# EAGLE design Reason (EAGLE 6.5.0)
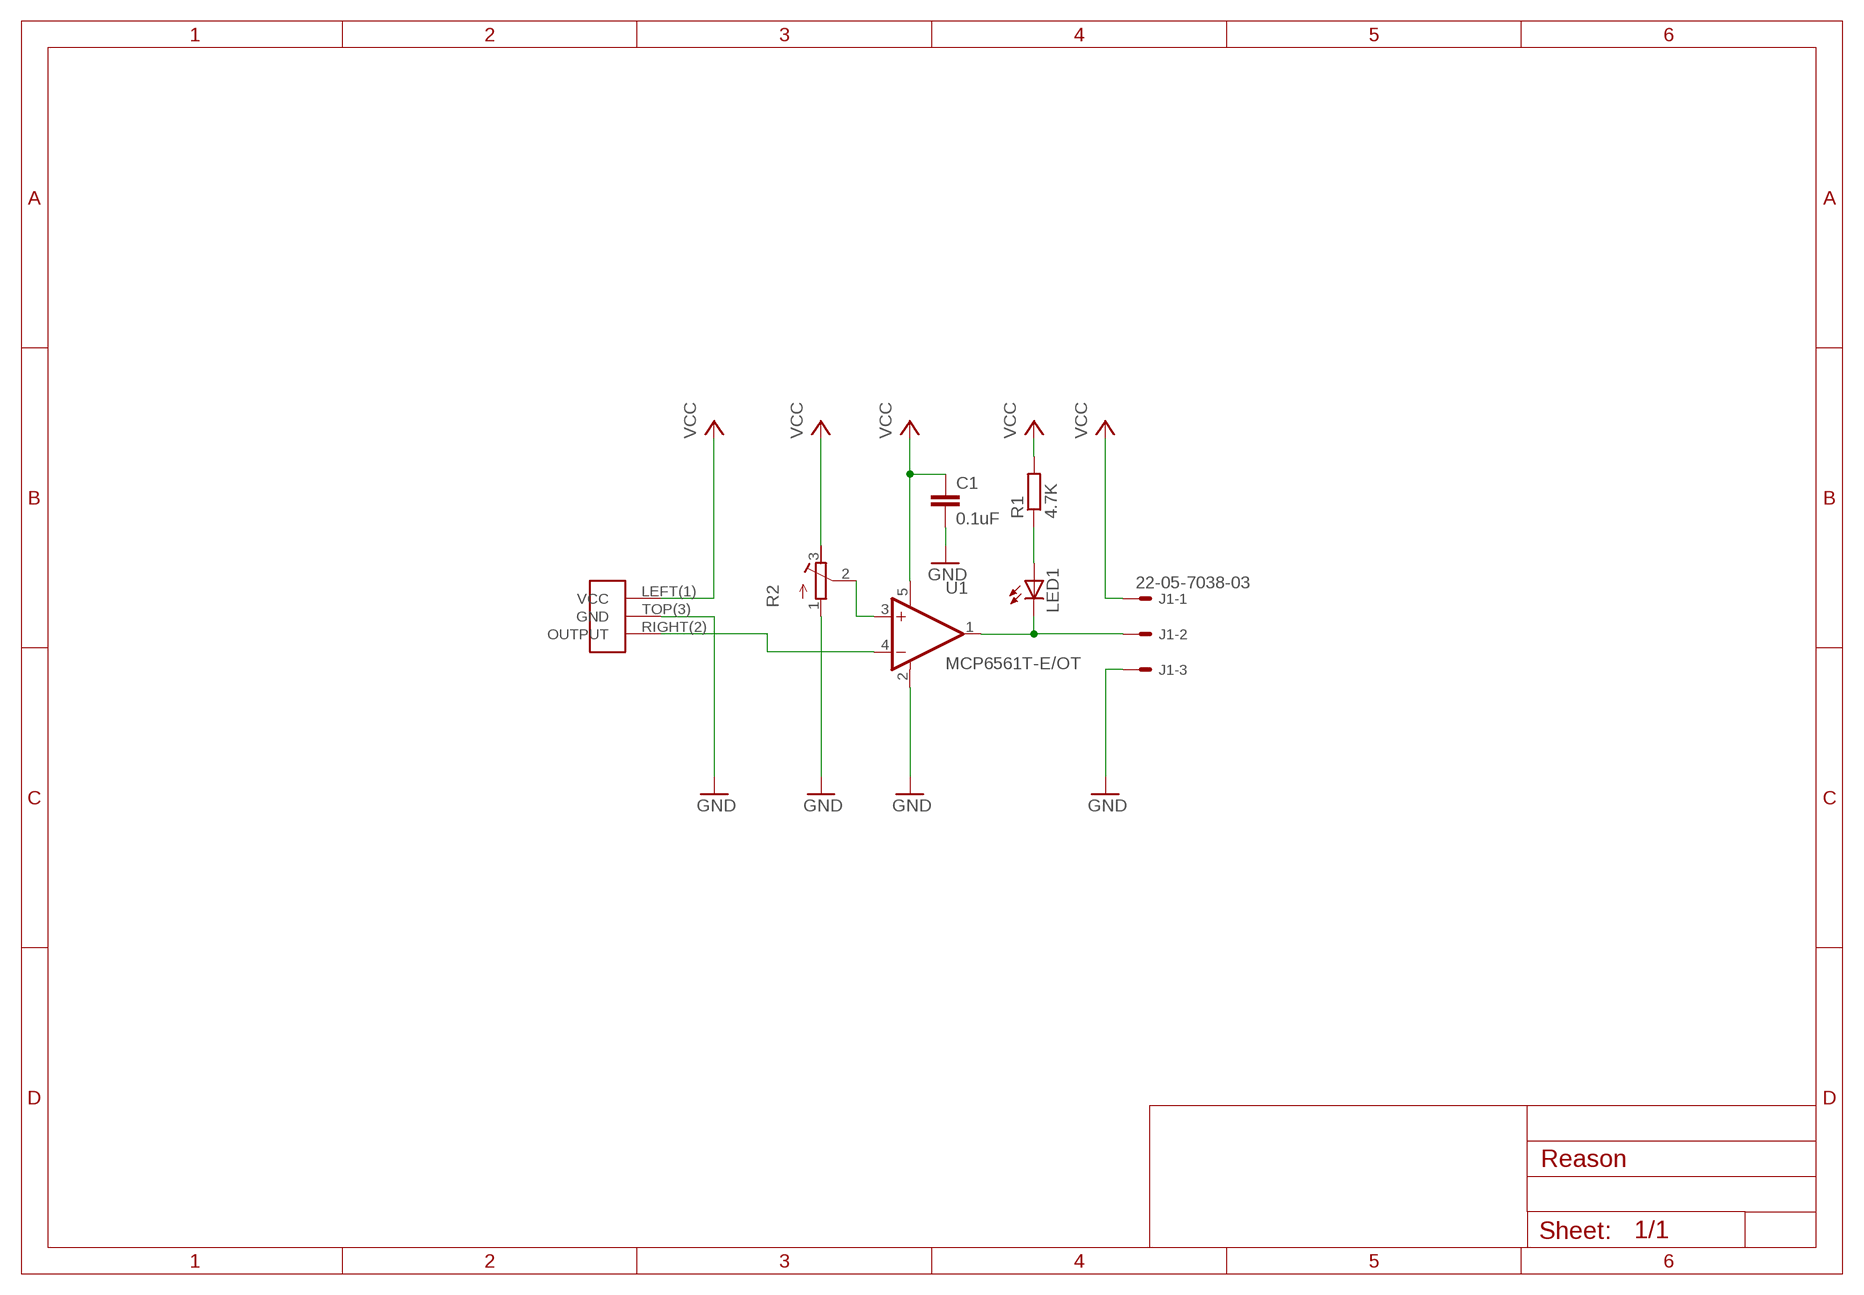
[diagram p0: schematic, sheet 1]

## Parts
C1  0.1uF  C-EUC0402  [C0402]
J1  22-05-7038-03  [7395-03]
LED1  LEDCHIPLED_0603  [CHIPLED_0603]
R1  4.7K  R-EU_R0402  [R0402]
R2  R-TRIMM5W  [RTRIM5W]
U1  MCP6561T-E/OT  [SOT95P270X145-5N]
U2  SS39ET  [SOT-23]

## Nets
GND: C1.2 J1.3 R2.1(E) U1.2(VSS) U2.TOP(3)(GND)
N$1: J1.2 LED1.C U1.1(VOUT)
N$2: LED1.A R1.1
N$3: R2.2(S) U1.3(VIN+)
N$5: U1.4(VIN-) U2.RIGHT(2)(OUTPUT)
VCC: C1.1 J1.1 R1.2 R2.3(A) U1.5(VDD) U2.LEFT(1)(VCC)

## Library data of the parts
C1 = resistor:C-EU: CAPACITOR, European symbol
J1 = con-molex:22-?-03: CONNECTOR wire to board 2.54 mm (.1 inch) pitch header; OC_FARNELL: unknown; OC_NEWARK: unknown
LED1 = led:LED: LED OSRAM: - CHIPLED LG R971, LG N971, LY N971, LG Q971, LY Q971, LO R971, LY R971 LH N974, LH R974 LS Q976, LO Q976, LY Q976 LO Q996 - Hyper CHIPLED LW Q18S LB Q993, LB Q99A, LB R99A - SideLED LS A670, LO A670, LY A670, LG A670, LP A670 LB A673, LV A673, LT A673, LW A673 LH A674 LY A675 LS A676, LA A676, LO A676, LY A676, LW A676 LS A679, LY A679, LG A679 - Hyper Micro SIDELED® LS Y876, LA Y876, LO Y876, LY Y876 LT Y87S - SmartLED LW L88C, LW L88S LB L89C, LB L89S, LG L890 LS L89K, LO L89K, LY L89K LS L896, LA L896, LO L896, LY L896 - TOPLED LS T670, LO T670, LY T670, LG T670, LP T670 LSG T670, LSP T670, LSY T670, LOP T670, LYG T670 LG T671, LOG T671, LSG T671 LB T673, LV T673, LT T673, LW T673 LH T674 LS T676, LA T676, LO T676, LY T676, LB T676, LH T676, LSB T676, LW T676 LB T67C, LV T67C, LT T67C, LS T67K, LO T67K, LY T67K, LW E67C LS E67B, LA E67B, LO E67B, LY E67B, LB E67C, LV E67C, LT E67C LW T67C LS T679, LY T679, LG T679 LS T770, LO T770, LY T770, LG T770, LP T770 LB T773, LV T773, LT T773, LW T773 LH T774 LS E675, LA E675, LY E675, LS T675 LS T776, LA T776, LO T776, LY T776, LB T776 LHGB T686 LT T68C, LB T68C - Hyper Mini TOPLED® LB M676 - Mini TOPLED Santana® LG M470 LS M47K, LO M47K, LY M47K Source: http://www.osram.convergy.de LUXEON: - LUMILED® LXK2-PW12-R00, LXK2-PW12-S00, LXK2-PW14-U00, LXK2-PW14-V00 LXK2-PM12-R00, LXK2-PM12-S00, LXK2-PM14-U00 LXK2-PE12-Q00, LXK2-PE12-R00, LXK2-PE12-S00, LXK2-PE14-T00, LXK2-PE14-U00 LXK2-PB12-K00, LXK2-PB12-L00, LXK2-PB12-M00, LXK2-PB14-N00, LXK2-PB14-P00, LXK2-PB14-Q00 LXK2-PR12-L00, LXK2-PR12-M00, LXK2-PR14-Q00, LXK2-PR14-R00 LXK2-PD12-Q00, LXK2-PD12-R00, LXK2-PD12-S00 LXK2-PH12-R00, LXK2-PH12-S00 LXK2-PL12-P00, LXK2-PL12-Q00, LXK2-PL12-R00 Source: www.luxeon.com KINGBRIGHT: KA-3528ASYC Source: www.kingbright.com
R1 = resistor:R-EU_: RESISTOR, European symbol
R2 = resistor:R-TRIMM: Trimm resistor
U1 = Microchip-MCP6:MCP6: Low-Power Operational Amplifiers,SOT23-5; MPN: MCP6561T-E/OT; OC_FARNELL: 1715874; OC_NEWARK: 45P4725; PACKAGE: SOT23-5; SUPPLIER: Microchip
U2 = Replicape:SS39ET

## Board
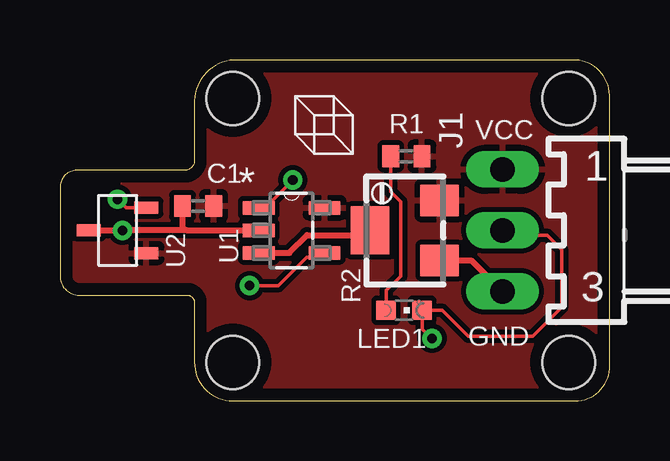
[diagram p1: board, top side]
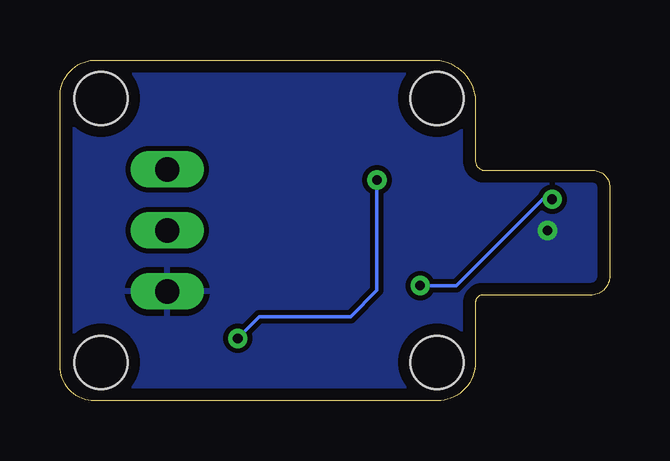
[diagram p2: board, bottom side, seen from below]

Size 22.91 x 14.2 mm. Coordinates in mm from the lower left corner, seen from the top.
Outline: 22.9,1.6 22.9,12.6 arc90 21.5,14.2 7.4,14.2 arc90 5.6,12.5 5.6,10 arc-90 5.2,9.6 0.7,9.6 arc90 0,8.9 0,5.2 arc90 0.8,4.4 5.3,4.4 arc-90 5.6,4.1 5.6,1.6 arc90 7.2,0 21.6,0 arc90 22.9,1.6
Copper layers (1*16): Top 0.035mm / dielectric 1.5mm / Bottom 0.035mm
Design rules "default *": minimum track width 6mil, minimum drill 0.3mm, track to track 8mil, track to pad 8mil, pad to pad 8mil, via to via 8mil, smd to smd 8mil, copper to edge 20mil, drill to drill 8mil, minimum pad ring 10mil, minimum via ring 8mil, stop-mask expansion 4mil, vias tented up to drill 0mil, thermal gap 10mil
Holes 2.2 mm at 7.2,12.6 7.2,1.6 21.2,1.6 21.2,12.6

### Footprints (pad centres in the part's own frame; a part is rotated, then mirrored left to right if it is on the bottom)
C0402 = smd 0.7 x 0.9: 1 -0.65,0; 2 0.65,0
7395-03 = drill 1.016 long: 1 2.54,0; 2 0,0; 3 -2.54,0
CHIPLED_0603 = smd 0.8 x 0.8: A 0,-0.75; C 0,0.75
R0402 = smd 0.7 x 0.9: 1 -0.65,0; 2 0.65,0
RTRIM5W = smd 1.3 x 1.6: 1 -1.25,-1.45; 3 1.25,-1.45 | smd 2 x 1.6: 2 0,1.45
SOT95P270X145-5N = smd 1.321 x 0.559: 1 -1.372,0.94; 2 -1.372,0; 3 -1.372,-0.94; 4 1.372,-0.94; 5 1.372,0.94
SOT-23 = smd 0.5 x 1: LEFT(1) -0.95,-2; RIGHT(2) 0.95,-2; TOP(3) 0,0.4

### Placement (x,y rotation side)
C1  5.75,8.12 180 top
J1  18.44,7.1 90 top
LED1  14.33,3.77 270 top
R1  14.43,10.19 0 top
R2  14.37,7.1 90 top
U1  9.65,7.1 0 top
U2  1.6,7.1 90 top

### Tracks (layer width: path | path; a pad name or v marks a point on that pad's centre or on a via)
GND  (via drill 0.4)
  Top 0.254: 5.3,7.1 U1.2 | R2.1 17.13,5.85 J1.3 | C1.2 5.1,7.2 5.3,7.1 | 5.3,7.1 v2.6,7.1 U2.TOP(3)
  pour Bottom: -0.3,14.1 23.5,14.2 23.5,-0.1 -0.3,-0.2
N$1  (via drill 0.4)
  Top 0.152: 8.44,7.94 v9.7,9.2 | v15.5,2.6 15.1,2.99 15.1,3.7 LED1.C 15.93,3.77 17,2.7 19.7,2.7 20.9,3.9 20.9,6.3 20.3,6.9 18.52,6.9 J1.2
  Top 0.254: U1.1 8.44,7.94
  Bottom 0.152: v9.7,9.2 9.7,4.6 10.8,3.5 14.6,3.5 v15.5,2.6
N$2
  Top 0.152: R1.1 13.78,8.72 14.2,8.3 14.2,5.2 13.6,4.6 13.6,3.79 LED1.A
N$3
  Top 0.254: U1.3 9.56,6.16 10.3,6.9 12.82,6.9 R2.2
N$5  (via drill 0.4)
  Top 0.152: v2.4,8.4 2.75,8.05 U2.RIGHT(2) | U1.4 11.1,5.98 10.28,5.98 9.1,4.8 v7.9,4.8
  Bottom 0.152: v2.4,8.4 2.8,8.4 6.4,4.8 v7.9,4.8
VCC
  pour Top: -0.3,14.1 23.5,14.2 23.5,-0.1 -0.3,-0.2

### Text on the board
tPlace: VCC | GND